# EAGLE design BATT_BUTTONS (EAGLE 9.6.2)
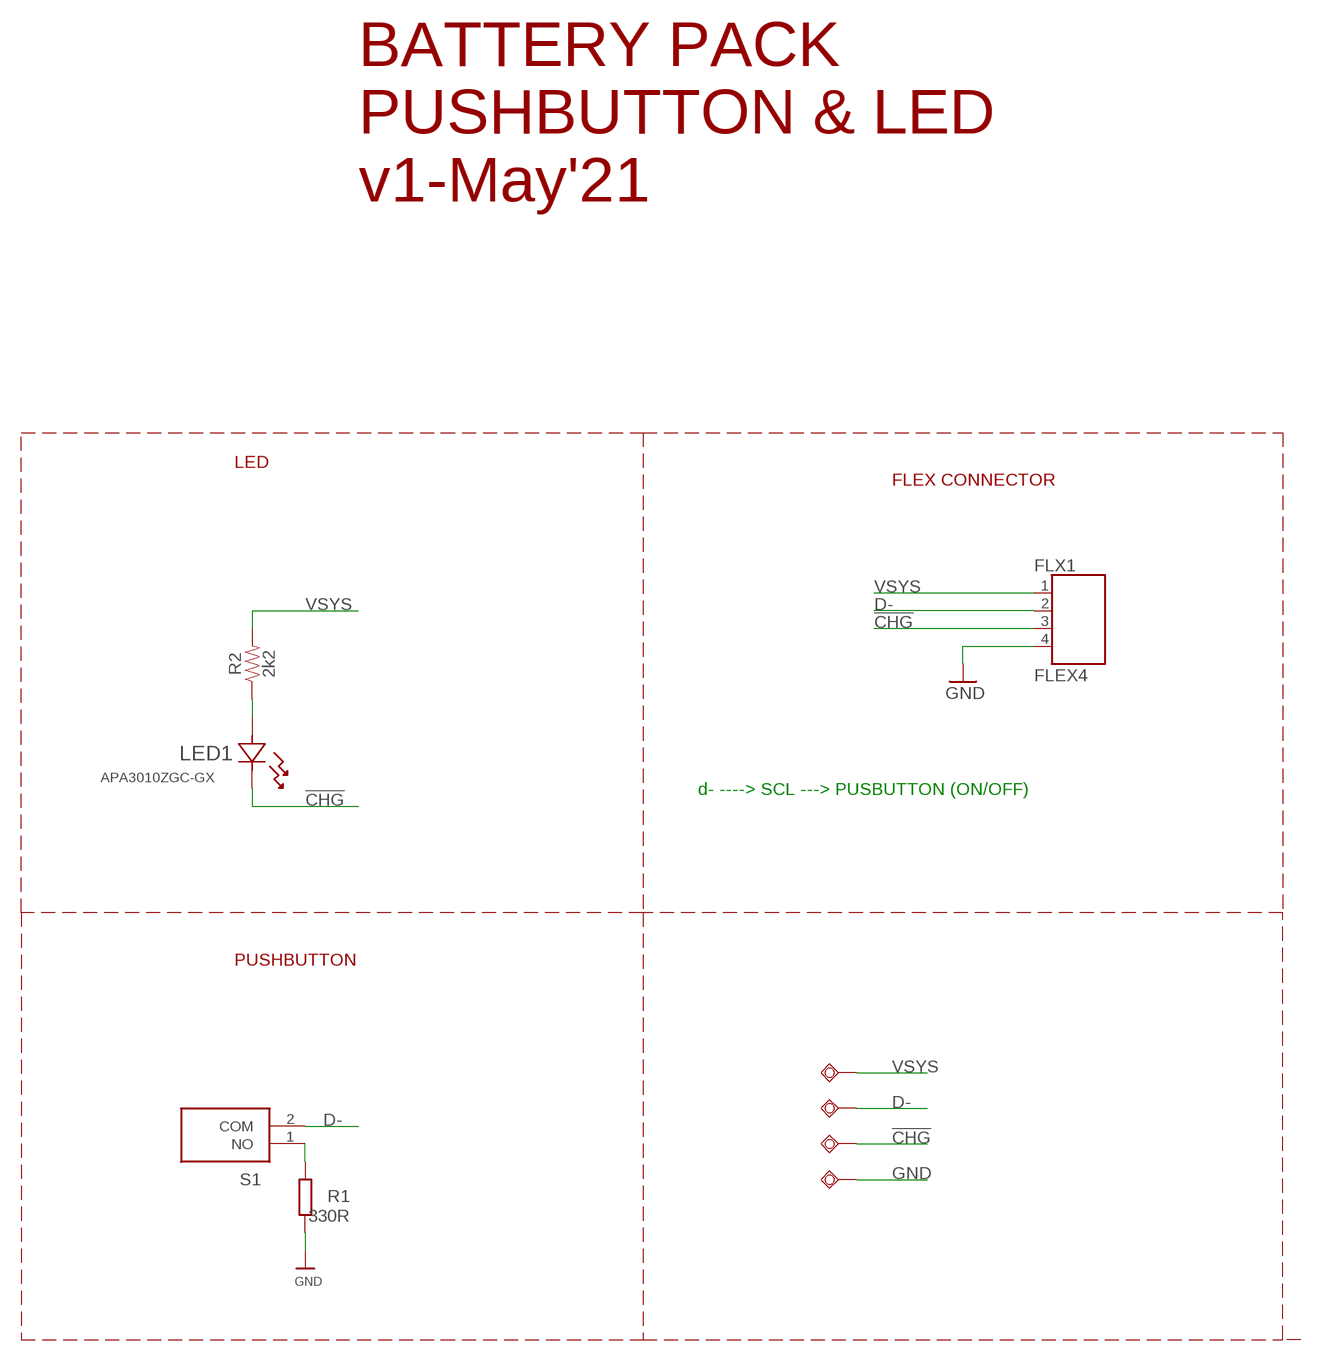
[diagram p0: schematic, sheet 1]

## Parts
!CHG  TESTPAD_TPSQB1,27  [TESTPAD_B1,27]
D-  TESTPAD_TPSQB1,27  [TESTPAD_B1,27]
FLX1  FLEX4  [FLEX4]
GND  TESTPAD_TPSQB1,27  [TESTPAD_B1,27]
LED1  APA3010ZGC-GX  APA3010SRCPRV-GX  [LED_APA3010SRCPRV-GX_KNB]
R1  330R  R-EU_R0603  [R0603]
R2  2k2  RESISTOR0402  [0402]
S1  KXT311LHS  [KXT311LHS]
VSYS  TESTPAD_TPSQB1,27  [TESTPAD_B1,27]

## Nets
!CHG!: !CHG.TP FLX1.3 LED1.1
D-: D-.TP FLX1.2 S1.2(COM)
GND: FLX1.4 GND.TP R1.1
N$1: R1.2 S1.1(NO)
N$2: LED1.2 R2.1
VSYS: FLX1.1 R2.2 VSYS.TP

## Notes on the sheet
- BATTERY PACK
  PUSHBUTTON & LED
  v1-May'21
- LED
- FLEX CONNECTOR
- d- ----> SCL ---> PUSBUTTON (ON/OFF)
- PUSHBUTTON

## Library data of the parts
!CHG D- GND VSYS = BeagleBone_Blue_R3:TESTPAD_TPSQ: Test pad
FLX1 = Flex4:FLEX4
LED1 = APA3010 Led:APA3010SRCPRV-GX; BUILT_BY: EMA_Cory; COPYRIGHT: Copyright (C) 2018 Accelerated Designs. All rights reserved; DATASHEET: https://www.kingbrightusa.com/images/catalog/SPEC/APA3010SRCPRV-GX.pdf; MANUFACTURER_PART_NUMBER: APA3010SRCPRV-GX; SOURCELIBRARY: Add_to_database_2020-11-13; VENDOR: Kingbright
R1 = rcl:R-EU_: RESISTOR, European symbol; SPICEPREFIX: R
R2 = SparkFun-Resistors:RESISTOR: Generic Resistor Package
S1 = switch momentary CK KXT311LHS:KXT311LHS: Tactile Switches 20mA 15VDC 100gf 0.6mm SPST NO SMT Source: Datasheet <https://datasheet.lcsc.com/szlcsc/C-K-KXT311LHS_C221820.pdf>; DESCRIPTION: Tactile Switches 20mA 15VDC 100gf 0.6mm SPST NO SMT; HEIGHT: 0.7mm; MANUFACTURER_NAME: C & K COMPONENTS; MANUFACTURER_PART_NUMBER: KXT311LHS; MOUSER_PART_NUMBER: 611-KXT311LHS; MOUSER_PRICE-STOCK: https://www.mouser.co.uk/ProductDetail/CK/KXT311LHS/?qs=%2FQ2qp2Z%2FWFxZqSWVDr5IpA%3D%3D

## Net classes
1 power: width 0.178 mm
2 gnd: width 0.305 mm, drill 0.483 mm, clearance 0.203 mm

## Board
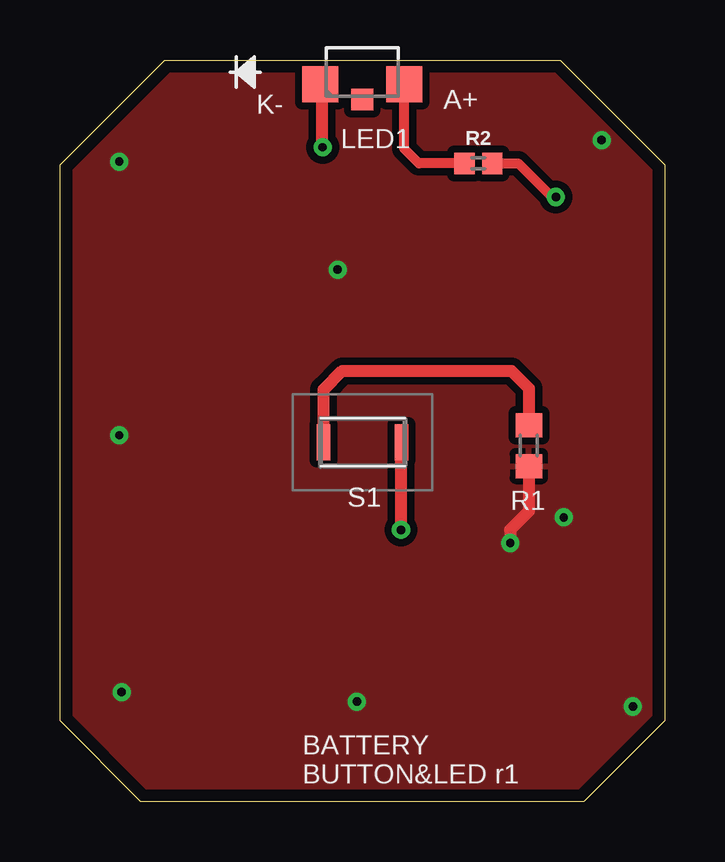
[diagram p1: board, top side]
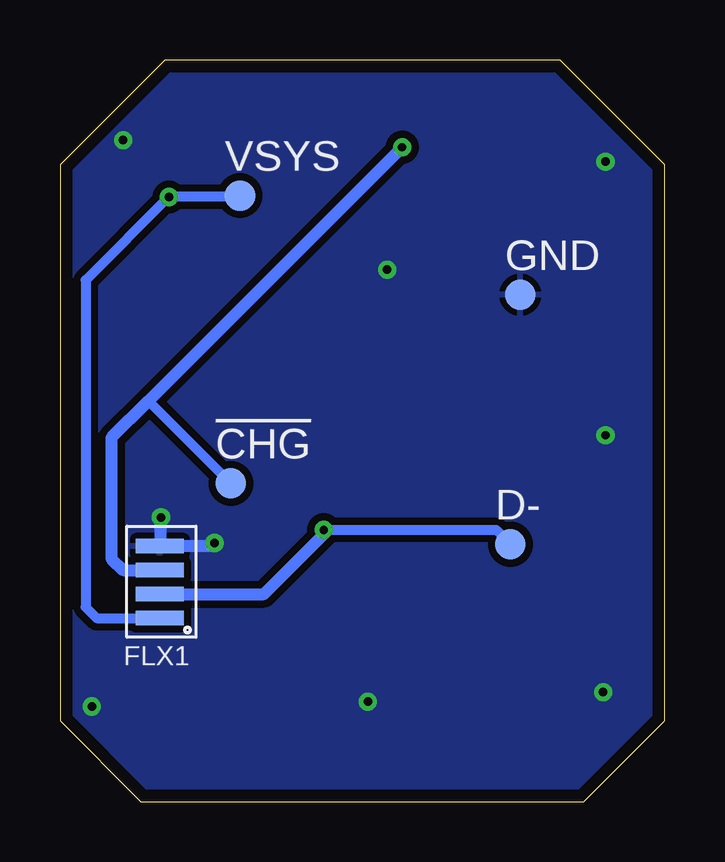
[diagram p2: board, bottom side, seen from below]

Size 25.2 x 30.9 mm. Coordinates in mm from the lower left corner, seen from the top.
Outline: 4.36,30.9 20.84,30.9 25.2,26.54 25.2,3.37 21.83,0 3.37,0 0,3.37 0,26.54 4.36,30.9
Copper layers (1*16): Top 0.035mm / dielectric 1.5mm / Bottom 0.035mm
Design rules "default *": minimum track width 6mil, minimum drill 0.3mm, track to track 10mil, track to pad 10mil, pad to pad 10mil, via to via 10mil, smd to smd 6mil, copper to edge 20mil, drill to drill 6mil, minimum pad ring 10mil, minimum via ring 8mil, stop-mask expansion 4mil, vias tented up to drill 50mil, thermal gap 10mil

### Footprints (pad centres in the part's own frame; a part is rotated, then mirrored left to right if it is on the bottom)
TESTPAD_B1,27 = smd 1.27 x 1.27: TP 0,0
FLEX4 = smd 0.6 x 2: 1 -3.77,1.52; 2 -2.77,1.52; 3 -1.77,1.52; 4 -0.77,1.52
LED_APA3010SRCPRV-GX_KNB = smd 1.499 x 1.499: 1 -0.5,1.75; 2 -0.5,-1.75 | smd 0.9 x 0.9: 3 -1.15,0
R0603 = smd 1 x 1.1: 1 -0.85,0; 2 0.85,0
0402 = smd 0.85 x 0.9: 1 -0.58,0; 2 0.58,0
KXT311LHS = smd 0.55 x 1.5: 1 -1.625,0; 2 1.625,0

### Placement (x,y rotation side)
!CHG  18.08,13.26 0 bottom
D-  6.43,10.72 0 bottom
FLX1  19.52,11.41 90 bottom
GND  6.02,21.11 0 bottom
LED1  12.6,30.4 90 top
R1  19.54,14.83 90 top
R2  17.43,26.59 0 top
S1  12.61,14.96 0 top
VSYS  17.7,25.25 0 bottom

### Tracks (layer width: path | path; a pad name or v marks a point on that pad's centre or on a via)
!CHG!  (via drill 0.35)
  Top 0.508: LED1.1 10.91,29.83 10.91,27.3 v10.95,27.26
  Bottom 0.406: !CHG.TP 21.5,16.68 21.53,16.68
  Bottom 0.508: v10.95,27.26 21.53,16.68 23.06,15.15 23.06,10.13 22.57,9.64 FLX1.3
D-  (via drill 0.35)
  Top 0.508: v14.21,11.32 14.21,14.94 S1.2
  Bottom 0.406: v14.21,11.32 7.03,11.32 D-.TP
  Bottom 0.508: FLX1.2 16.71,8.64 14.21,11.14 v14.21,11.32
GND  (via drill 0.35)
  Top 0.508: R1.1 19.54,12.1 18.76,11.32 v18.76,10.77
  Bottom 0.508: v18.76,10.77 18.89,10.64 FLX1.4 21.01,10.68 21.01,11.83 v20.99,11.84
  other vias: 2.47,26.66 2.57,4.56 12.37,4.16 23.87,3.96 2.47,15.26 11.57,22.16 22.57,27.56
  pour Top (isolate 0.305): -0.53,31.06 -0.53,3.06 3.17,-0.64 22.27,-0.64 26.07,3.16 26.07,27.26 22.27,31.06
  pour Bottom (isolate 0.305): 25.77,31.16 25.77,2.16 22.97,-0.64 22.67,-0.94 3.17,-0.94 3.07,-0.94 -0.83,2.96 -0.83,27.26 3.47,31.56 25.77,31.56
N$1
  Top 0.508: S1.1 10.98,17.16 11.77,17.95 18.81,17.95 19.54,17.22 R1.2
N$2
  Top 0.406: R2.1 14.95,26.59 14.35,27.2 LED1.2
VSYS  (via drill 0.35)
  Top 0.406: R2.2 19.09,26.59 20.49,25.19 v20.66,25.19
  Bottom 0.406: FLX1.1 23.67,7.64 24.13,8.1 24.13,21.72 v20.66,25.19 17.76,25.19 VSYS.TP

### Text on the board
tNames: K- | A+ | BATTERY / BUTTON&LED r1